# Altium schematic sheet Sheet_1_2022-06-28.schdoc
size 270 x 157 mm
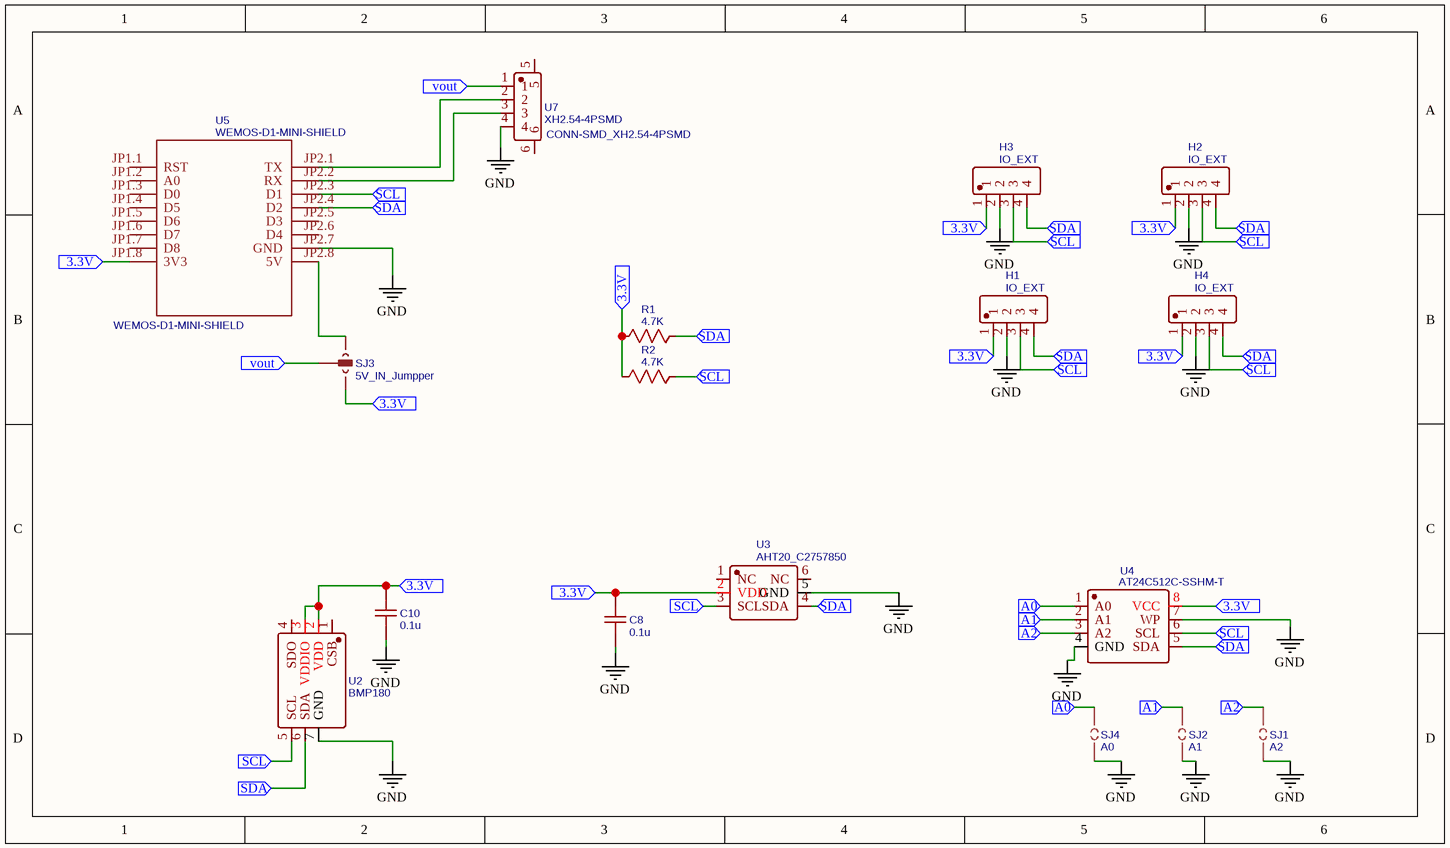
[diagram p0: Sheet_1_2022-06-28.schdoc]

## Parts
C8  0.1u  [C0805]
C10  0.1u  [C0805]
H1  IO_EXT  [HDR-TH_4P-P2.54-V-M]
H2  IO_EXT  [HDR-TH_4P-P2.54-V-M]
H3  IO_EXT  [HDR-TH_4P-P2.54-V-M]
H4  IO_EXT  [HDR-TH_4P-P2.54-V-M]
R1  4.7K  [R0805]
R2  4.7K  [R0805]
SJ1  A2  [PAD-JUMPER-2-NO_NO_SILK]
SJ2  A1  [PAD-JUMPER-2-NO_NO_SILK]
SJ3  5V_IN_Jumpper  [PAD-JUMPER-3-NO_YES_SILK]
SJ4  A0  [PAD-JUMPER-2-NO_NO_SILK]
U2  BMP180  [LGA-7_L3.8-W3.6-P1.50-BL]
U3  AHT20_C2757850  [SENSOR-SMD_L3.0-W3.0-P1.00-BR]
U4  AT24C512C-SSHM-T  [SOP-8_L5.0-W4.0-P1.27-LS6.2-BL]
U5  WEMOS-D1-MINI-SHIELD  [WEMOS-D1-MINI-SHIELD]
U7  XH2.54-4PSMD  [CONN-SMD_XH2.54-4PSMD]

## Ports
3.3V (in), A0 (in), A1 (in), A2 (in), SCL (in), SDA (in), vout (in)

## Nets
GND: C8.1 C10.1 H1.2 H2.2 H3.2 H4.2 SJ1.1 SJ2.1 SJ4.1 U2.7(GND) U3.5(GND) U4.4(GND) U4.7(WP) U5.JP2.7(GND) U7.4
3.3V: C8.2 C10.2 H1.1 H2.1 H3.1 H4.1 R1.2 R2.2 SJ3.3 U2.2(VDD) U2.3(VDDIO) U3.2(VDD) U4.8(VCC) U5.JP1.8(3V3) ; port 3.3V
A0: SJ4.2 U4.1(A0) ; port A0
A1: SJ2.2 U4.2(A1) ; port A1
A2: SJ1.2 U4.3(A2) ; port A2
SCL: H1.3 H2.3 H3.3 H4.3 R2.1 U2.5(SCL) U3.3(SCL) U4.6(SCL) U5.JP2.3(D1) ; port SCL
SDA: H1.4 H2.4 H3.4 H4.4 R1.1 U2.6(SDA) U3.4(SDA) U4.5(SDA) U5.JP2.4(D2) ; port SDA
vout: SJ3.2 U7.1 ; port vout
NetSJ3_1: SJ3.1 U5.JP2.8(5V)
NetU5_JP2.1: U5.JP2.1(TX) U7.2
NetU5_JP2.2: U5.JP2.2(RX) U7.3

Not connected (* = marked no-connect by the designer): U2 1(CSB) 4(SDO); U3 1(NC) 6(NC); U5 JP1.1(RST) JP1.2(A0) JP1.3(D0) JP1.4(D5) JP1.5(D6) JP1.6(D7) JP1.7(D8) JP2.5(D3) JP2.6(D4); U7 5 6

## Notes on the sheet
- (in symbol XH2.54-4PSMD) CONN-SMD_XH2.54-4PSMD

## Library data of the parts
C8 C10 = 0.1u: nameAlias: Value(F); Contributor: LCEDA_Lib; spicePre: C; spiceSymbolName: C_0805_US
H1-H4 = IO_EXT: BOM_Manufacturer: XKB Connectivity; BOM_Manufacturer Part: X6511WV-04H-C30D60; Contributor: LCSC; BOM_Supplier: LCSC; BOM_Supplier Part: C706876; BOM_JLCPCB Part Class: Extended Part; spicePre: H; spiceSymbolName: X6511WV-04H-C30D60
R1 R2 = 4.7K: nameAlias: Value(Ω); Contributor: LCEDA_Lib; spicePre: R; spiceSymbolName: R_0805_US
SJ1 = A2: Contributor: torusww; Package Display: No; spicePre: S; spiceSymbolName: JUMPER-PAD-2-NO
SJ2 = A1: Contributor: torusww; Package Display: No; spicePre: S; spiceSymbolName: JUMPER-PAD-2-NO
SJ3 = 5V_IN_Jumpper: Contributor: SparkFun; spicePre: S; spiceSymbolName: JUMPER-PAD-3-NOYES_SILK
SJ4 = A0: Contributor: torusww; Package Display: No; spicePre: S; spiceSymbolName: JUMPER-PAD-2-NO
U2 = BMP180: BOM_Manufacturer: Bosch Sensortec; Contributor: LCSC; BOM_Supplier: LCSC; BOM_Supplier Part: C438474; BOM_Manufacturer Part: BMP180; BOM_JLCPCB Part Class: Extended Part; spicePre: U; spiceSymbolName: BMP180
U3 = AHT20_C2757850: BOM_Manufacturer: 广州奥松; BOM_Manufacturer Part: AHT20; Contributor: LCSC; BOM_Supplier: LCSC; BOM_Supplier Part: C2757850; link: https://atta.szlcsc.com//upload/public/pdf/source/20200407/C503357_487829B2F97386053400E2E73B0ABB4D.pdf; BOM_JLCPCB Part Class: Extended Part; spicePre: U; spiceSymbolName: AHT20_C2757850
U4 = AT24C512C-SSHM-T: BOM_Manufacturer: MICROCHIP; BOM_Supplier: LCSC; BOM_Manufacturer Part: AT24C512C-SSHM-T; BOM_Supplier Part: C54668; BOM_JLCPCB Part Class: Extended Part; spicePre: U; spiceSymbolName: AT24C512C-SSHM-T
U5 = WEMOS-D1-MINI-SHIELD: description: Template for WEMOS D1 mini compatible shields; Package Display: Yes; spicePre: U; spiceSymbolName: WEMOS-D1-MINI-SHIELD
U7 = XH2.54-4PSMD: BOM_Manufacturer: null; Contributor: LCSC; Package Display: Yes; BOM_Supplier: LCSC; BOM_Supplier Part: C9900001014; BOM_Manufacturer Part: XH2.54-4PSMD; BOM_JLCPCB Part Class: Extended Part; link: https://cn.bing.com/search?q=datasheet: XH2.54-4PSMD; spicePre: U; spiceSymbolName: XH2.54-4PSMD